# Altium project PCB_Project_V_4.PrjPcb
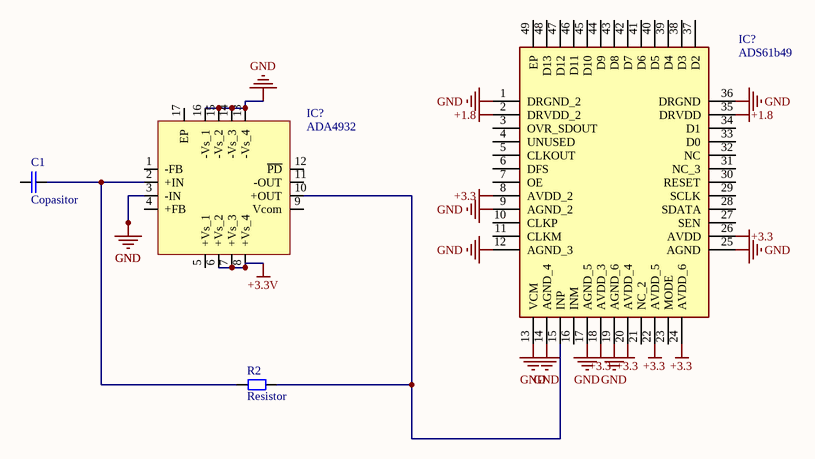
[diagram p0: V_4.SchDoc]
1 sheet, 4 parts. Net scope: global (net labels, ports and power ports of the same name join across sheets).
Board file: V_4.PcbDoc

## Sheet V_4.SchDoc
size A4

### Parts
(Parts that share a designator on the sheet are numbered #1, #2 ... from top to bottom, then left to right.)
C1  Copasitor  [Copasitor]
IC?#1  ADA4932  [ADA4932]
IC?#2  ADS61b49  [ADS61b49]
R2  Resistor  [Resistor]

### Nets
+1.8: IC?#2.2(DRVDD_2) IC?#2.35(DRVDD)
+3.3: IC?#2.8(AVDD_2) IC?#2.18(AVDD_3) IC?#2.20(AVDD_4) IC?#2.22(AVDD_5) IC?#2.24(AVDD_6) IC?#2.26(AVDD)
+3.3V: IC?#1.6(+Vs_2) IC?#1.7(+Vs_3) IC?#1.8(+Vs_4)
GND: IC?#1.3(-IN) IC?#1.13(-Vs_4) IC?#1.14(-Vs_3) IC?#1.15(-Vs_2) IC?#1.16(-Vs_1) IC?#2.1(DRGND_2) IC?#2.9(AGND_2) IC?#2.12(AGND_3) IC?#2.13(VCM) IC?#2.14(AGND_4) IC?#2.17(AGND_5) IC?#2.19(AGND_6) IC?#2.25(AGND) IC?#2.36(DRGND)
NetC1_2: C1.2 IC?#1.2(+IN) R2.1
NetIC?#1_10: IC?#1.10(+OUT) IC?#2.15(INP) R2.2

Not connected (* = marked no-connect by the designer): C1 1; IC?#1 1(-FB) 4(+FB) 5(+Vs_1) 9(Vcom) 11(-OUT) 12(~{PD}) 17(EP); IC?#2 3(OVR_SDOUT) 4(UNUSED) 5(CLKOUT) 6(DFS) 7(OE) 10(CLKP) 11(CLKM) 16(INM) 21(NC_2) 23(MODE) 27(SEN) 28(SDATA) 29(SCLK) 30(RESET) 31(NC_3) 32(NC) 33(D0) 34(D1) 37(D2) 38(D3) 39(D4) 40(D5) 41(D6) 42(D7) 43(D8) 44(D9) 45(D10) 46(D11) 47(D12) 48(D13) 49(EP)